# Altium project DotexBoard_PRJ.PrjPcb
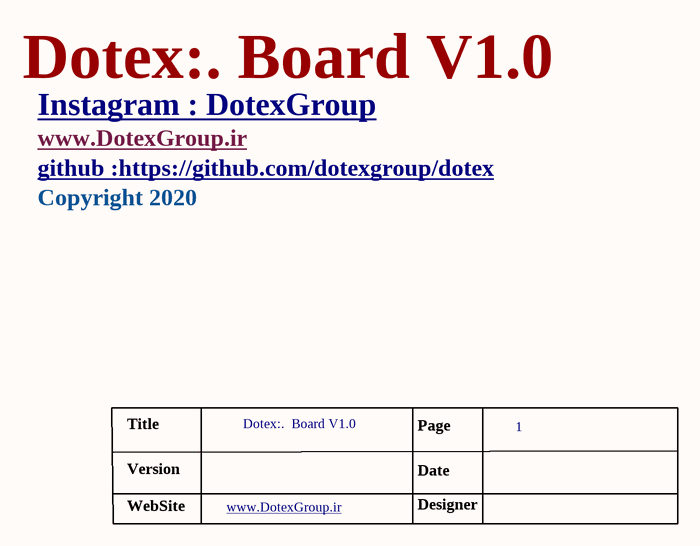
[diagram p0: [00]_DoteXGroup.SchDoc]
designer: Dotex:.; version: V1.0
4 sheets, 114 parts. Net scope: flat (ports and power ports of the same name join across sheets).
Board file: DotexBoard_PCB.PcbDoc
Sheets:
  [00]_DoteXGroup.SchDoc
  [1]DotexBoard_MCU.SchDoc
  [2]DotexBoard_ENC28J60.SchDoc
  [3]DotexBoard_Interfaces.SchDoc

## Sheet [00]_DoteXGroup.SchDoc
size A

### Notes on the sheet
- Dotex:. Board V1.0
- Instagram : DotexGroup <https://www.instagram.com/dotexgroup/>
- www.DotexGroup.ir <http://www.DotexGroup.ir>
- Copyright 2020
- github :https://github.com/dotexgroup/dotex <https://github.com/dotexgroup/dotex>
- Title
- Dotex:.  Board V1.0
- Page
- 1
- Version
- WebSite
- www.DotexGroup.ir <http://www.DotexGwww.DotexGroup.irroup.ir>
- Date
- Designer

## Sheet [1]DotexBoard_MCU.SchDoc
size B
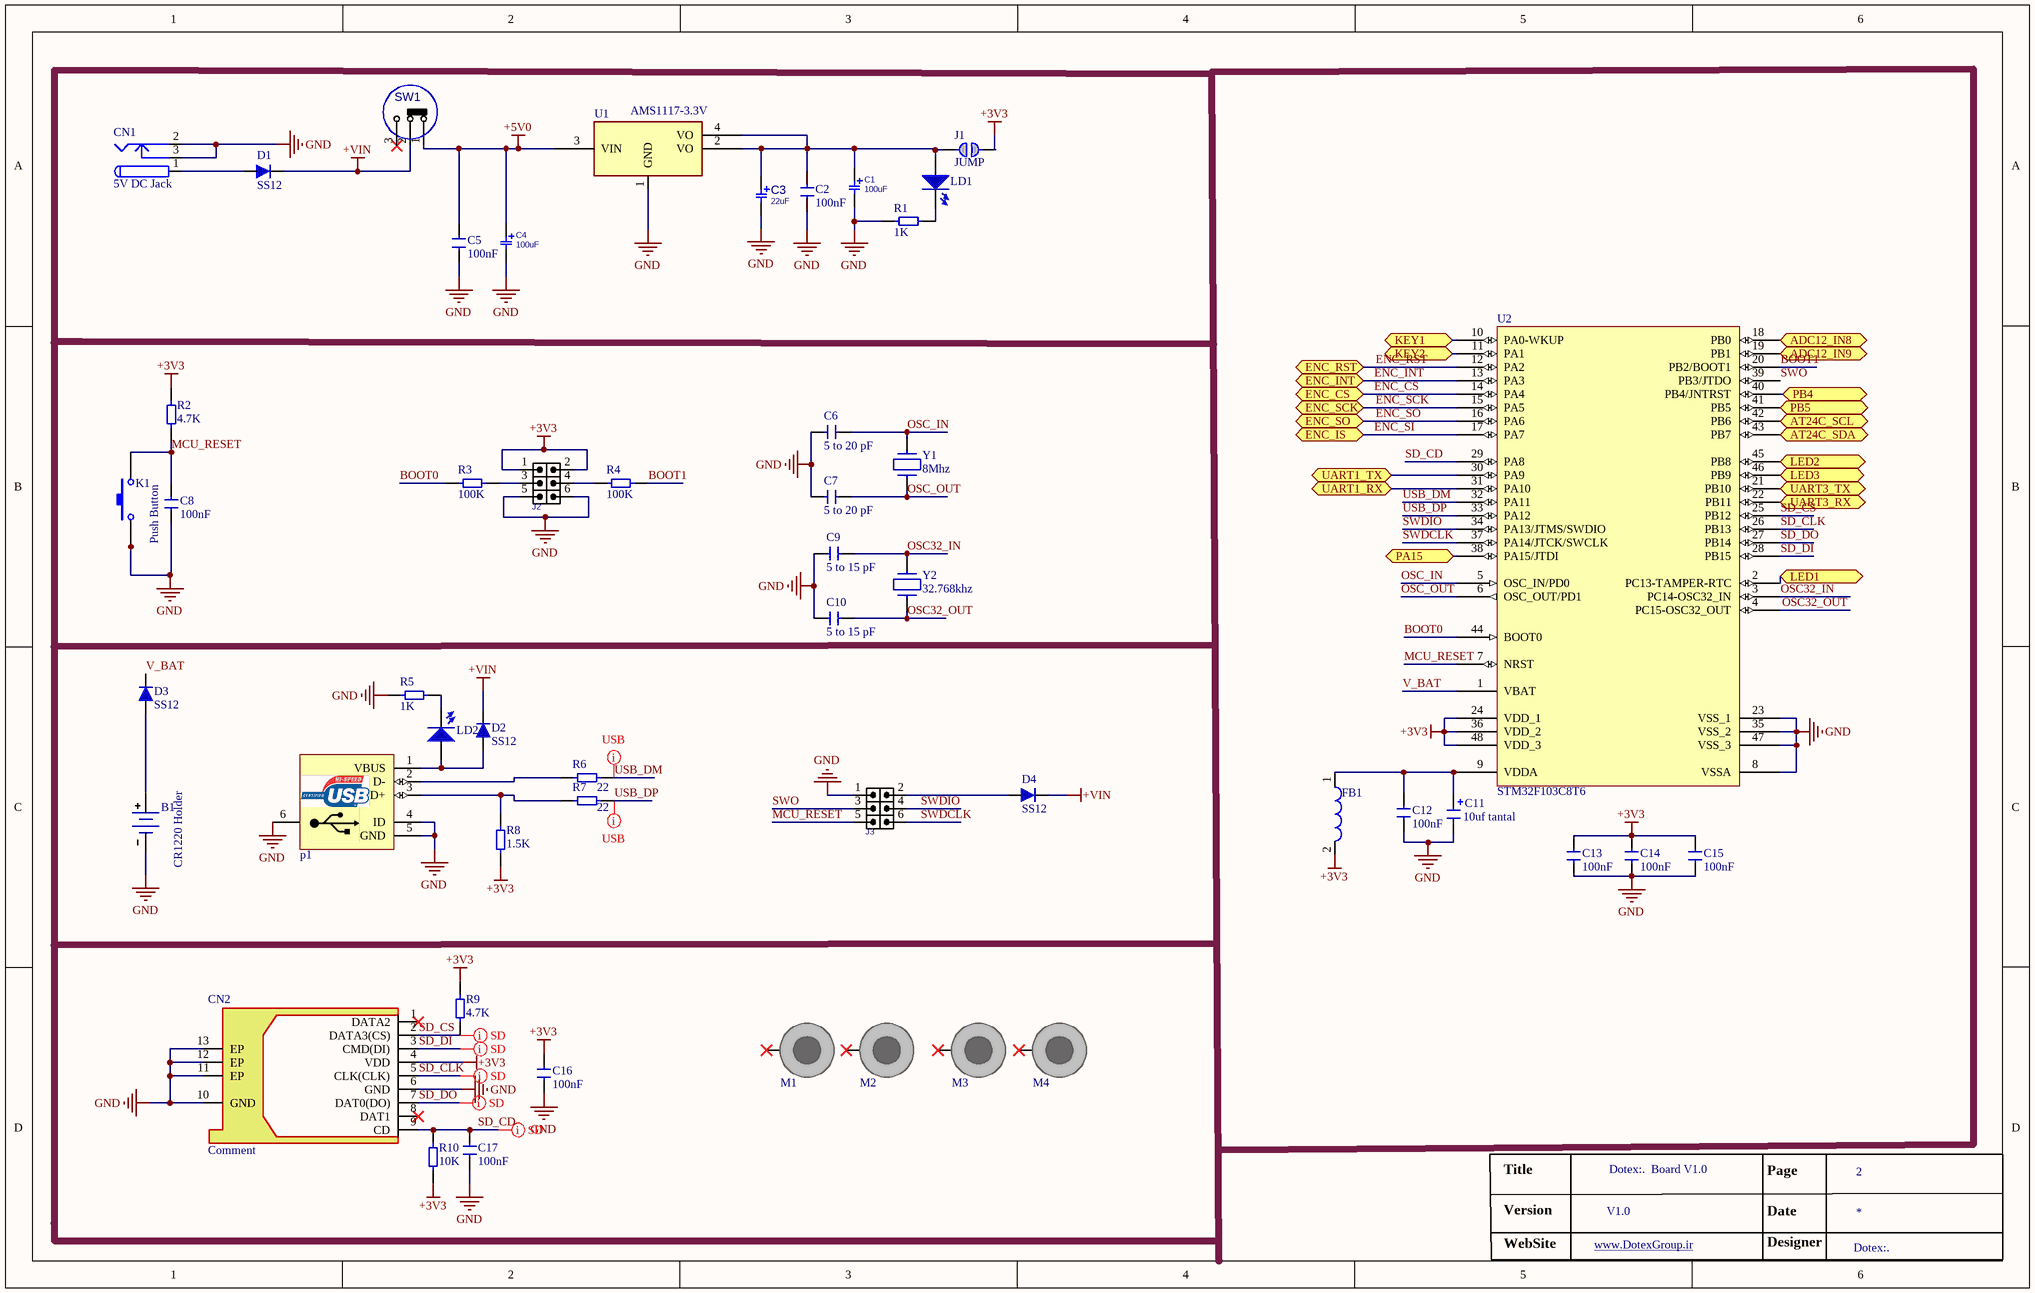
[diagram p1: [1]DotexBoard_MCU.SchDoc]

### Parts
B1  CR1220 Holder  [Battery socket SMD]
C1  value 100uF  [C_EL_6_6]  (hidden comment: Comment)
C2  Comment  [0805 Capacitor]  (value not drawn)
C3  22uF  [C_EL_5]
C4  value 100uF  [C_EL_6_6]  (hidden comment: Comment)
C5  Comment  [0805 Capacitor]  (value not drawn)
C6  Comment  [0805 Capacitor]  (value not drawn)
C7  Comment  [0805 Capacitor]  (value not drawn)
C8  Comment  [0805 Capacitor]  (value not drawn)
C9  Comment  [0805 Capacitor]  (value not drawn)
C10  Comment  [0805 Capacitor]  (value not drawn)
C11  10uf tantal  [Tantalium Size A]
C12  Comment  [0805 Capacitor]  (value not drawn)
C13  Comment  [0805 Capacitor]  (value not drawn)
C14  Comment  [0805 Capacitor]  (value not drawn)
C15  Comment  [0805 Capacitor]  (value not drawn)
C16  Comment  [0805 Capacitor]  (value not drawn)
C17  Comment  [0805 Capacitor]  (value not drawn)
CN1  5V DC Jack  [Power Jack]
CN2  Comment  [Micro SD Card]
D1  SS12  [DO-214AC(SMA)]
D2  SS12  [DO-214AC(SMA)]
D3  SS12  [DO-214AC(SMA)]
D4  SS12  [DO-214AC(SMA)]
FB1  Comment  [0805 Ferrit Bead]  (value not drawn)
J1  JUMP  [0805 Capacitor]
J2  HDRM_2X3  [HDR_M_2X3]  (value not drawn)
J3  HDRM_2X3  [HDR_M_2X3]  (value not drawn)
K1  Push Button  [Push Kay 4 KFC]
LD1  LED  [LED_0805 Y]  (value not drawn)
LD2  LED  [LED_0805 Y]  (value not drawn)
M1  Comment  [SCMH_M3]  (value not drawn)  (no BOM)
M2  Comment  [SCMH_M3]  (value not drawn)  (no BOM)
M3  Comment  [SCMH_M3]  (value not drawn)  (no BOM)
M4  Comment  [SCMH_M3]  (value not drawn)  (no BOM)
p1  USB Connector  [USB_AB_BM_SHS]  (value not drawn)
R1  Comment  [0805 Resistor]  (value not drawn)
R2  Comment  [0805 Resistor]  (value not drawn)
R3  Comment  [0805 Resistor]  (value not drawn)
R4  Comment  [0805 Resistor]  (value not drawn)
R5  Comment  [0805 Resistor]  (value not drawn)
R6  Comment  [0805 Resistor]  (value not drawn)
R7  Comment  [0805 Resistor]  (value not drawn)
R8  Comment  [0805 Resistor]  (value not drawn)
R9  Comment  [0805 Resistor]  (value not drawn)
R10  Comment  [0805 Resistor]  (value not drawn)
SW1  SlideSwitch  [SWSLIDT_SPDT_R_8X4]  (value not drawn)
U1  value AMS1117-3.3V  [SOT223_4]  (hidden comment: Comment)
U2  STM32F103C8T6  [LQFP48_N]
Y1  8Mhz  [Xtal 2p]
Y2  32.768khz  [Xtal 32.782khz]

### Ports
ADC12_IN8 (bidir), ADC12_IN9 (bidir), AT24C_SCL (bidir), AT24C_SDA (bidir), ENC_CS (bidir), ENC_INT (bidir), ENC_IS (bidir), ENC_RST (bidir), ENC_SCK (bidir), ENC_SO (bidir), KEY1 (bidir), KEY2 (bidir), LED1 (bidir), LED2 (bidir), LED3 (bidir), PA15 (bidir), PB4 (bidir), PB5 (bidir), UART1_RX (bidir), UART1_TX (bidir), UART3_RX (bidir), UART3_TX (bidir)

### Nets
+3V3: C13.2 C14.2 C15.2 C16.2 CN2.4(VDD) FB1.2 J1.2 J2.1 J2.2 R2.1 R8.1 R9.1 R10.2 U2.24(VDD_1) U2.36(VDD_2) U2.48(VDD_3)
+5V0: C4.1 C5.2 SW1.1(P1) U1.3(VIN)
+VIN: D1.2(K) D2.2(K) D4.2(K) SW1.2(P3)
GND: B1.2(-) C1.2 C2.1 C3.2 C4.2 C5.1 C6.1 C7.2 C8.2 C9.1 C10.2 C11.2 C12.1 C13.1 C14.1 C15.1 C16.1 C17.2 CN1.2 CN1.3 CN2.6(GND) CN2.10(GND) CN2.11(EP) CN2.12(EP) CN2.13(EP) J2.5 J2.6 J3.1 K1.1 p1.4(ID) p1.5(GND) p1.6(MH) R1.2 R5.2 U1.1(GND) U2.8(VSSA) U2.23(VSS_1) U2.35(VSS_2) U2.47(VSS_3)
AIN8: U2.18(PB0) ; port ADC12_IN8
AIN9: U2.19(PB1) ; port ADC12_IN9
BOOT0: R3.1 U2.44(BOOT0)
BOOT1: R4.2 U2.20(PB2/BOOT1)
ENC_CS: U2.14(PA4) ; port ENC_CS
ENC_INT: U2.13(PA3) ; port ENC_INT
ENC_RST: U2.12(PA2) ; port ENC_RST
ENC_SCK: U2.15(PA5) ; port ENC_SCK
ENC_SI: U2.17(PA7) ; port ENC_IS
ENC_SO: U2.16(PA6) ; port ENC_SO
MCU_RESET: C8.1 J3.5 K1.2 R2.2 U2.7(NRST)
OSC32_IN: C9.2 U2.3(PC14-OSC32_IN) Y2.1
OSC32_OUT: C10.1 U2.4(PC15-OSC32_OUT) Y2.2
OSC_IN: C6.2 U2.5(OSC_IN/PD0) Y1.2
OSC_OUT: C7.1 U2.6(OSC_OUT/PD1) Y1.1
PA15: U2.38(PA15/JTDI) ; port PA15
PB4: U2.40(PB4/JNTRST) ; port PB4
PB5: U2.41(PB5) ; port PB5
RX: U2.22(PB11) ; port UART3_RX
SD_CD: C17.1 CN2.9(CD) R10.1 U2.29(PA8)
SD_CLK: CN2.5(CLK(CLK)) U2.26(PB13)
SD_CS: CN2.2(DATA3(CS)) R9.2 U2.25(PB12)
SD_DI: CN2.3(CMD(DI)) U2.28(PB15)
SD_DO: CN2.7(DAT0(DO)) U2.27(PB14)
SWDCLK: J3.6 U2.37(PA14/JTCK/SWCLK)
SWDIO: J3.4 U2.34(PA13/JTMS/SWDIO)
SWO: J3.3 U2.39(PB3/JTDO)
TX: U2.21(PB10) ; port UART3_TX
USB_DM: R6.2 U2.32(PA11)
USB_DP: R7.2 U2.33(PA12)
V_BAT: D3.2(K) U2.1(VBAT)
NetB1_1: B1.1(+) D3.1(A)
NetC1_1: C1.1 C2.2 C3.1 J1.1 LD1.1(A) U1.2(VO) U1.4(VO)
NetC11_1: C11.1 C12.2 FB1.1 U2.9(VDDA)
NetC29_1: U2.10(PA0-WKUP) ; port KEY1
NetC30_1: U2.11(PA1) ; port KEY2
NetCN1_1: CN1.1 D1.1(A)
NetD2_1: D2.1(A) LD2.1(A) p1.1(VBUS)
NetD4_1: D4.1(A) J3.2
NetJ2_3: J2.3 R3.2
NetJ2_4: J2.4 R4.1
NetLD1_2: LD1.2(K) R1.1
NetLD2_2: LD2.2(K) R5.1
Netp1_2: p1.2(D-) R6.1
Netp1_3: p1.3(D+) R7.1 R8.2
NetR24_1: U2.2(PC13-TAMPER-RTC) ; port LED1
NetR25_1: U2.45(PB8) ; port LED2
NetR26_1: U2.46(PB9) ; port LED3
NetR27_2: U2.42(PB6) ; port AT24C_SCL
NetR28_2: U2.43(PB7) ; port AT24C_SDA
NetU2_30: U2.30(PA9) ; port UART1_TX
NetU2_31: U2.31(PA10) ; port UART1_RX

Not connected (* = marked no-connect by the designer): CN2 1(DATA2)* 8(DAT1)*; M1 1*; M2 1*; M3 1*; M4 1*; SW1 3(P4)*

### Layout directives
net class SD_card: SD_CD, SD_CLK, SD_CS, SD_DI, SD_DO
net class USB: USB_DM, USB_DP

### Notes on the sheet
- Title
- Dotex:.  Board V1.0
- Page
- 2
- Version
- WebSite
- www.DotexGroup.ir <http://www.DotexGwww.DotexGroup.irroup.ir>
- Date
- Designer
- (in symbol Capacitor SMD) 100nF; 5 to 20 pF; 5 to 15 pF
- (in symbol Resistor SMD) 1K; 4.7K; 100K; 22; 1.5K; 10K

### Library data of the parts
B1 = Battry Backup
C1 C4 = CAP_THD_EL_10u25V: CAP, THD, ELEC, 10uF, 25V; MANF_P#: MANF_PART#; PARAM: 25V; MANF: MANF; PARAM2: PARAM2
C2 C5-C10 C12-C17 = Capacitor SMD
C3 = CAP_SMD_EL_100u10V: CAP, SMDD, ELEC, 100uF, 10V; MANF_P#: 875105242010; MANF: Wurth Electronics; DESC: Aluminum Organic Polymer; DIST#: MOUSER; PARAM: 20%, 30mOhmESR, -55~105oC; PRICE: 0.56$; PARAM2: 10V; ASSEMBLY: ASSEMBLY; VALUE: 22uF
C11 = Capacitor Tantalium
CN1 = Power Jack
CN2 = Micro SD Card
D1-D4 = 1N4001
FB1 = Ferrit Bead
J1 = jumper SMD
J2 J3 = HDR_M_2X3: CONN, HEADER, Male, pitch: 2.54mm, 6POS; MANF_P#: MANF_PART#; MANF: MANF; VALUE: HDRM_2X3
K1 = Push Kay
LD1 LD2 = LED SMD
M1-M4 = SCMH_M1P6: SCREW mouting, M1.6, 1.6mm diameter and 3.2mm PanHead; VALUE: DNP/MH; ASSEMBLY: DNP
p1 = USB AB MICRO CONNECTOR: USB MICRO-B Type Connector; Designer: ABBAS BASEREH; Max Current: 1600mA; Mounting Technology: Surface Mount\Through-Hole; Category: Connector; Pin Count: 5-7; Publisher: ABBAS BASEREH; Status: Unreleased; ComponentLink1Description: Datasheet; ComponentLink2Description: Reference; Update: 1395-11-17
R1-R10 = Resistor SMD
SW1 = SWSLIDT_SPDT_S_8X4: SWITCH, SLIDE, SPDT, 8.6X4.3mm, THD; MANF_PART#: OS102011MS2QN1; MANF: C&K; DESC: DESCRIPTION; VALUE: SlideSwitch; ASSEMBLY: ASSEMBLY; PARAM: PARAM; PRICE: 0.4$
U1 = VREG_1117_SOT223: REG, Linear, LDO1V, 0.8A, SOT-223; MANF_P#: LD1117, LM1117, AMS1117, TLV1117, REG1117, NCP1117, LT1117, SPX1117; MANF: TI, ON, ST; PARAM2: 1.2/1.5/1.8/2.5/2.85/3.3/5V; PARAM: LDO1V, 0.8A
U2 = STM32F103C8T6: STM32 ARM-based 32-bit MCU with 64 Kbytes Flash, 48-pin LQFP, Industrial Temperature; Published: 30-May-2008; DatasheetVersion: rev6, Mar-2008; PackageVersion: Mar-2008; PackageReference: LQFP48; Publisher: Altium Limited; PackageDescription: 48-Pin Low-Profile Quad Flat Pack, 7 x 7 mm Body, 0.5 mm Pitch (LQFP48); ComponentLink1Description: Manufacturer Link; ComponentLink1URL: www.st.com/stm32; ComponentLink2Description: Datasheet; ComponentLink2URL: http://www.st.com/stonline/products/literature/ds/13587.pdf
Y1 Y2 = Xtal

## Sheet [2]DotexBoard_ENC28J60.SchDoc
size B
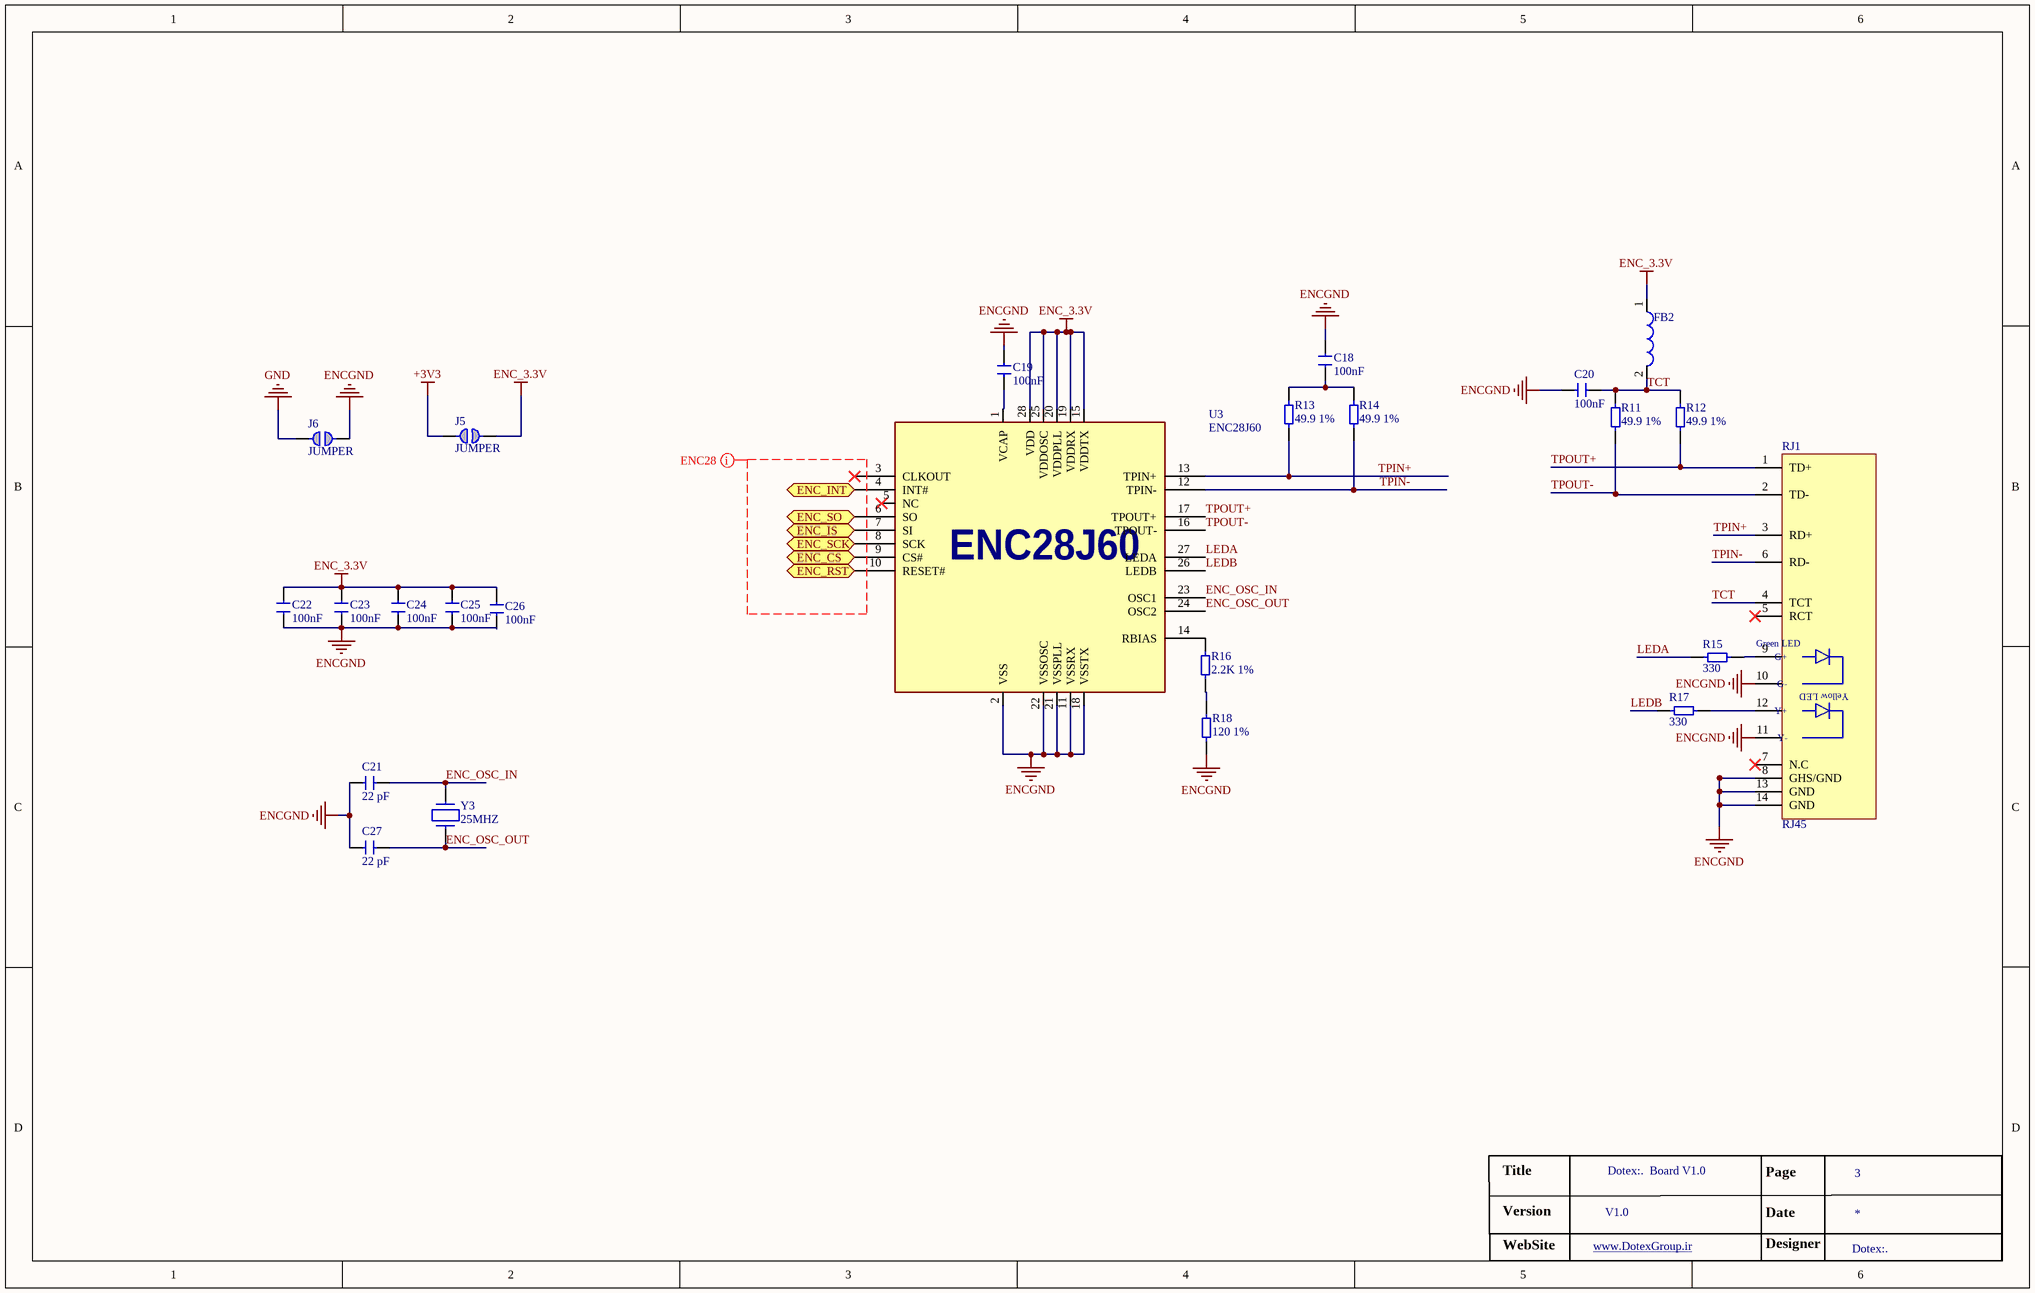
[diagram p2: [2]DotexBoard_ENC28J60.SchDoc]

### Parts
C18  Comment  [0805 Capacitor]  (value not drawn)
C19  Comment  [0805 Capacitor]  (value not drawn)
C20  Comment  [0805 Capacitor]  (value not drawn)
C21  Comment  [0805 Capacitor]  (value not drawn)
C22  Comment  [0805 Capacitor]  (value not drawn)
C23  Comment  [0805 Capacitor]  (value not drawn)
C24  Comment  [0805 Capacitor]  (value not drawn)
C25  Comment  [0805 Capacitor]  (value not drawn)
C26  Comment  [0805 Capacitor]  (value not drawn)
C27  Comment  [0805 Capacitor]  (value not drawn)
FB2  Comment  [0805 Ferrit Bead]  (value not drawn)
J5  JUMPER  [0603 Resistor]
J6  JUMPER  [0603 Resistor]
R11  Comment  [0805 Resistor]  (value not drawn)
R12  Comment  [0805 Resistor]  (value not drawn)
R13  Comment  [0805 Resistor]  (value not drawn)
R14  Comment  [0805 Resistor]  (value not drawn)
R15  Comment  [0805 Resistor]  (value not drawn)
R16  Comment  [0805 Resistor]  (value not drawn)
R17  Comment  [0805 Resistor]  (value not drawn)
R18  Comment  [0805 Resistor]  (value not drawn)
RJ1  RJ45  [HR91105A-RJ45]
U3  value ENC28J60  [SO_28_W]  (hidden comment: Comment)
Y3  25MHZ  [Xtal 2p]

### Ports
ENC_CS (bidir), ENC_INT (bidir), ENC_IS (bidir), ENC_RST (bidir), ENC_SCK (bidir), ENC_SO (bidir)

### Nets
+3V3: J5.1
ENC_3.3V: C22.2 C23.2 C24.2 C25.2 C26.2 FB2.1 J5.2 U3.15(VDDTX) U3.19(VDDRX) U3.20(VDDPLL) U3.25(VDDOSC) U3.28(VDD)
ENCGND: C18.1 C19.2 C20.2 C21.1 C22.1 C23.1 C24.1 C25.1 C26.1 C27.2 J6.2 R18.2 RJ1.8(GHS/GND) RJ1.10 RJ1.11 RJ1.13(GND) RJ1.14(GND) U3.2(VSS) U3.11(VSSRX) U3.18(VSSTX) U3.21(VSSPLL) U3.22(VSSOSC)
GND: J6.1
ENC_CS: U3.9(CS#) ; port ENC_CS
ENC_INT: U3.4(INT#) ; port ENC_INT
ENC_OSC_IN: C21.2 U3.23(OSC1) Y3.2
ENC_OSC_OUT: C27.1 U3.24(OSC2) Y3.1
ENC_RST: U3.10(RESET#) ; port ENC_RST
ENC_SCK: U3.8(SCK) ; port ENC_SCK
ENC_SI: U3.7(SI) ; port ENC_IS
ENC_SO: U3.6(SO) ; port ENC_SO
LEDA: R15.1 U3.27(LEDA)
LEDB: R17.2 U3.26(LEDB)
TCT: C20.1 FB2.2 R11.1 R12.1 RJ1.4(TCT)
TPIN+: R13.2 RJ1.3(RD+) U3.13(TPIN+)
TPIN-: R14.2 RJ1.6(RD-) U3.12(TPIN-)
TPOUT+: R12.2 RJ1.1(TD+) U3.17(TPOUT+)
TPOUT-: R11.2 RJ1.2(TD-) U3.16(TPOUT-)
NetC18_2: C18.2 R13.1 R14.1
NetC19_1: C19.1 U3.1(VCAP)
NetR15_2: R15.2 RJ1.9
NetR16_1: R16.1 U3.14(RBIAS)
NetR16_2: R16.2 R18.1
NetR17_1: R17.1 RJ1.12

Not connected (* = marked no-connect by the designer): RJ1 5(RCT)* 7(N.C)*; U3 3(CLKOUT)* 5(NC)*

### Layout directives
net class ENC28: (no net found under the mark)

### Notes on the sheet
- Title
- Dotex:.  Board V1.0
- Page
- 3
- Version
- Date
- Designer
- WebSite
- www.DotexGroup.ir <http://www.DotexGwww.DotexGroup.irroup.ir>
- Size:
- Date:
- B
- Number:
- Time:
- Revision:
- Sheet
- of
- File:
- (in symbol Capacitor SMD) 22 pF; 100nF
- (in symbol HR911105A) Green LED; G+; G-; Yellow LED; Y+; Y-
- (in symbol Resistor SMD) 2.2K 1%; 330; 49.9 1%; 120 1%

### Library data of the parts
C18-C27 = Capacitor SMD
FB2 = Ferrit Bead
J5 J6 = jumper SMD
R11-R18 = Resistor SMD
RJ1 = HR911105A
U3 = ENC28J60_SOP: Ethernet Controller, 10/100, MII/RMII; MANF: Microchip; MANF_P#: ENC28J60-I/SO, ENC28J60-C/SO
Y3 = Xtal

## Sheet [3]DotexBoard_Interfaces.SchDoc
size B
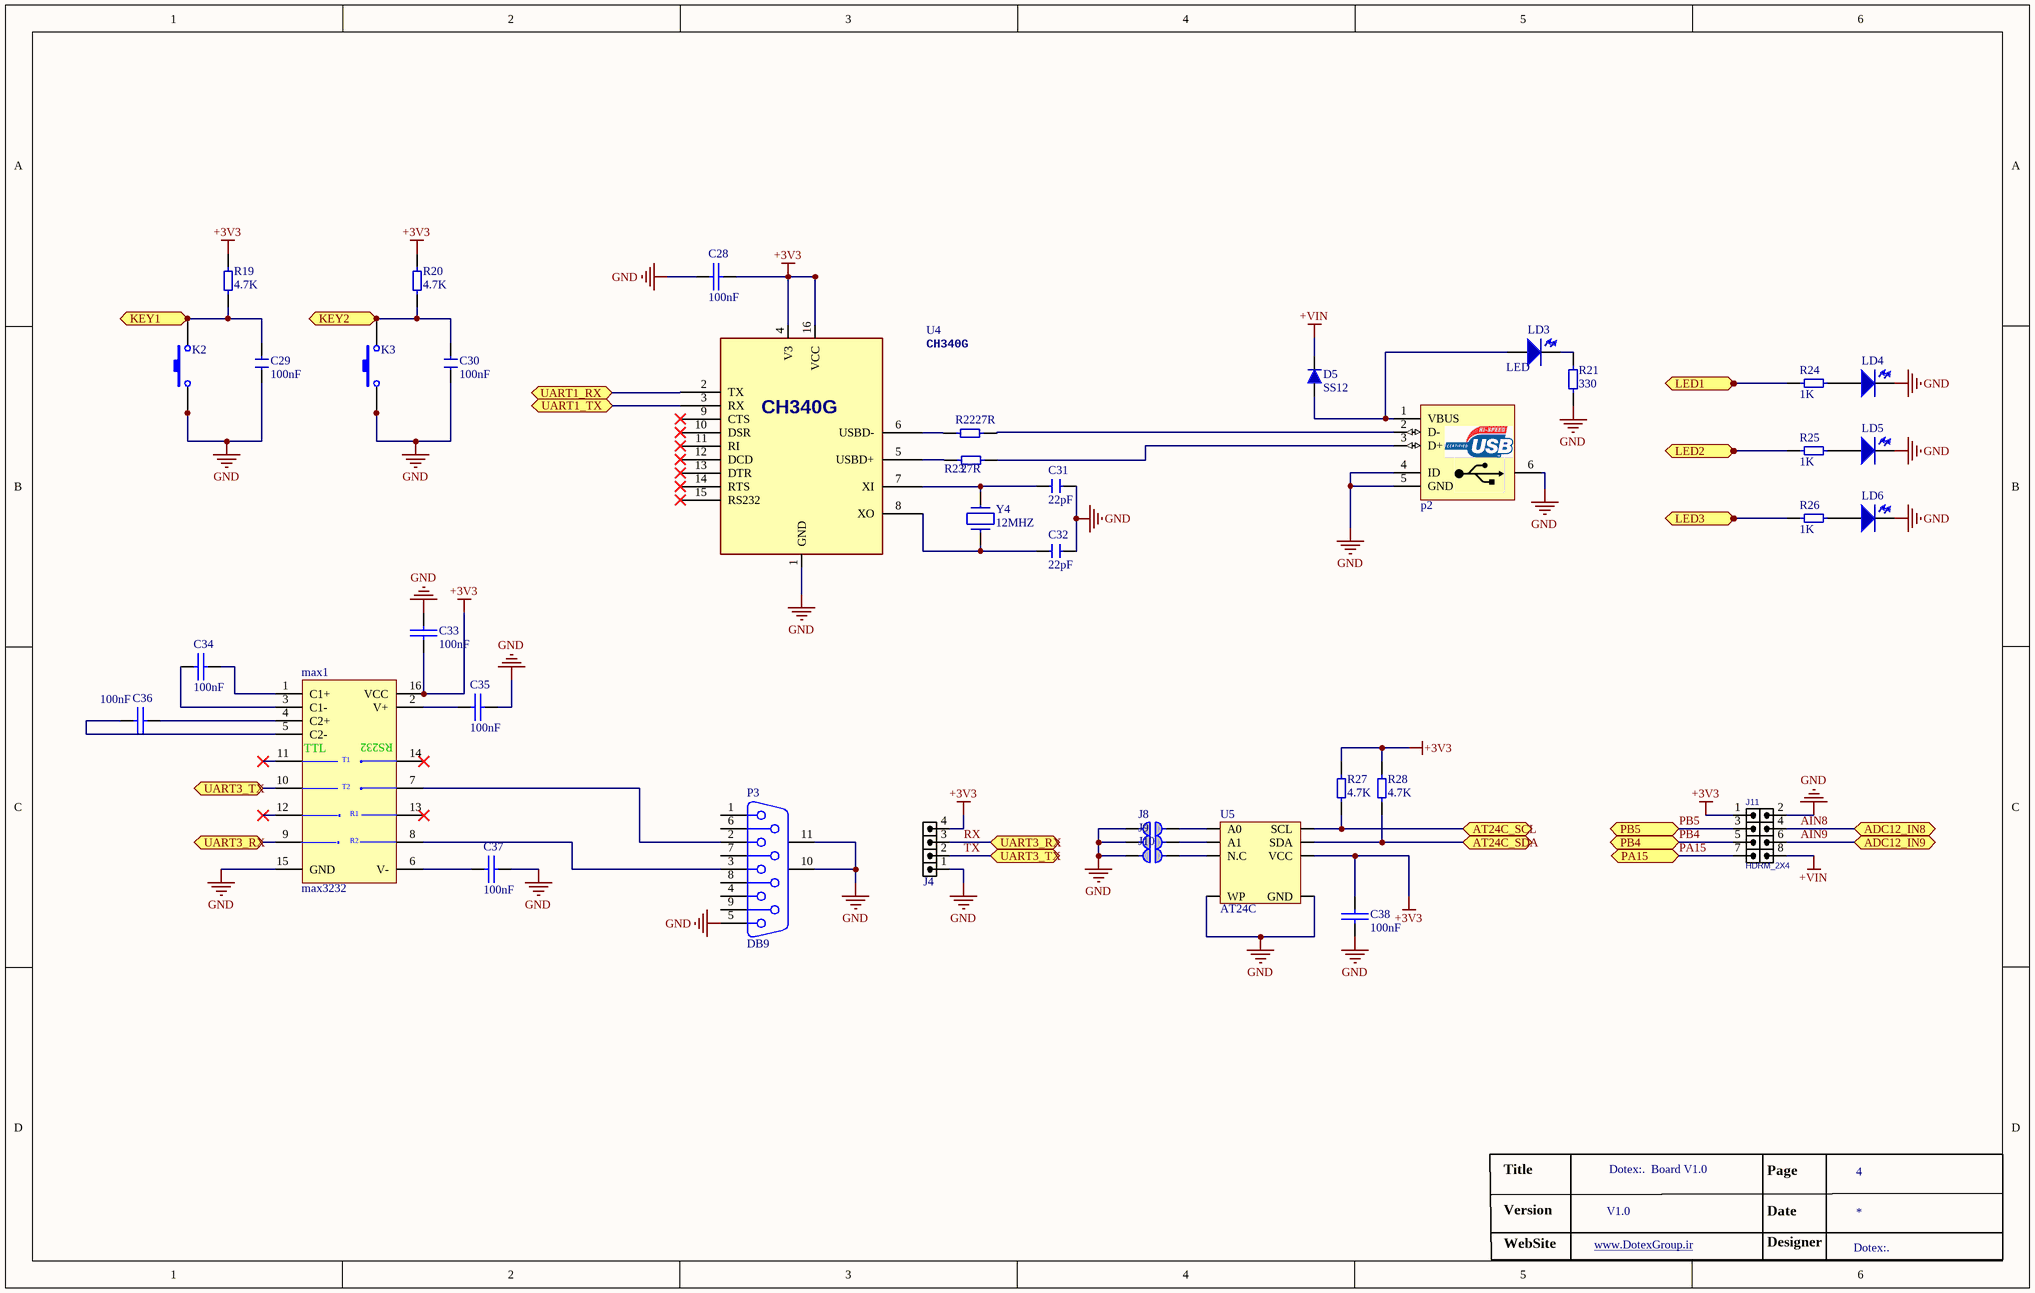
[diagram p3: [3]DotexBoard_Interfaces.SchDoc]

### Parts
C28  value 100nF  [0805 Capacitor]  (hidden comment: Comment)
C29  Comment  [0805 Capacitor]  (value not drawn)
C30  Comment  [0805 Capacitor]  (value not drawn)
C31  Comment  [0805 Capacitor]  (value not drawn)
C32  Comment  [0805 Capacitor]  (value not drawn)
C33  value 100nF  [0805 Capacitor]  (hidden comment: Comment)
C34  value 100nF  [0805 Capacitor]  (hidden comment: Comment)
C35  value 100nF  [0805 Capacitor]  (hidden comment: Comment)
C36  value 100nF  [0805 Capacitor]  (hidden comment: Comment)
C37  value 100nF  [0805 Capacitor]  (hidden comment: Comment)
C38  value 100nF  [0805 Capacitor]  (hidden comment: Comment)
D5  SS12  [DO-214AC(SMA)]
J4  HDR1X4  [HDR_M_1X4]  (value not drawn)
J8  Comment  [0603 Resistor]  (value not drawn)
J9  Comment  [0603 Resistor]  (value not drawn)
J10  Comment  [0603 Resistor]  (value not drawn)
J11  HDRM_2X4  [HDR_M_2X4]
K2  Comment  [Push Kay 4 KFC]  (value not drawn)
K3  Comment  [Push Kay 4 KFC]  (value not drawn)
LD3  LED  [LED_0805 Y]
LD4  Comment  [LED_0805 Y]  (value not drawn)
LD5  Comment  [LED_0805 Y]  (value not drawn)
LD6  Comment  [LED_0805 Y]  (value not drawn)
max1  max3232  [SO-16]
p2  USB Connector  [USB_AB_BM_SHS]  (value not drawn)
P3  DB9  [DB9 Female]
R19  Comment  [0805 Resistor]  (value not drawn)
R20  Comment  [0805 Resistor]  (value not drawn)
R21  Comment  [0805 Resistor]  (value not drawn)
R22  Comment  [0805 Resistor]  (value not drawn)
R23  Comment  [0805 Resistor]  (value not drawn)
R24  Comment  [0805 Resistor]  (value not drawn)
R25  Comment  [0805 Resistor]  (value not drawn)
R26  Comment  [0805 Resistor]  (value not drawn)
R27  Comment  [0805 Resistor]  (value not drawn)
R28  Comment  [0805 Resistor]  (value not drawn)
U4  CH340G  [SO-16]
U5  AT24C  [SOIC-8]
Y4  12MHZ  [Xtal 2p]

### Ports
ADC12_IN8 (bidir), ADC12_IN9 (bidir), AT24C_SCL (bidir), AT24C_SDA (bidir), KEY1 (bidir), KEY2 (bidir), LED1 (bidir), LED2 (bidir), LED3 (bidir), PA15 (bidir), PB4 (bidir), PB5 (bidir), UART1_RX (bidir), UART1_TX (bidir), UART3_RX (bidir), UART3_TX (bidir)

### Nets
+3V3: C28.2(-) C33.1(+) C38.1(+) J4.4 J11.1 max1.16(VCC) R19.1 R20.1 R27.1 R28.1 U4.4(V3) U4.16(VCC) U5.8(VCC)
+VIN: D5.2(K) J11.8
GND: C28.1(+) C29.2 C30.2 C31.1 C32.2 C33.2(-) C35.2(-) C37.2(-) C38.2(-) J4.1 J8.1 J9.1 J10.1 J11.2 K2.1 K3.1 LD4.2(K) LD5.2(K) LD6.2(K) max1.15(GND) p2.4(ID) p2.5(GND) p2.6(MH) P3.5 P3.10(MH1) P3.11(MH2) R21.2 U4.1(GND) U5.4(GND) U5.7(WP)
AIN8: J11.4 ; port ADC12_IN8
AIN9: J11.6 ; port ADC12_IN9
PA15: J11.7 ; port PA15
PB4: J11.5 ; port PB4
PB5: J11.3 ; port PB5
RX: J4.3 max1.9(R2OUT) ; port UART3_RX
TX: J4.2 max1.10(T2IN) ; port UART3_TX
NetC29_1: C29.1 K2.2 R19.2 ; port KEY1
NetC30_1: C30.1 K3.2 R20.2 ; port KEY2
NetC31_2: C31.2 U4.7(XI) Y4.2
NetC32_1: C32.1 U4.8(XO) Y4.1
NetC34_1: C34.1(+) max1.1(C1+)
NetC34_2: C34.2(-) max1.3(C1-)
NetC35_1: C35.1(+) max1.2(V+)
NetC36_1: C36.1(+) max1.5(C2-)
NetC36_2: C36.2(-) max1.4(C2+)
NetC37_1: C37.1(+) max1.6(V-)
NetD5_1: D5.1(A) LD3.1(A) p2.1(VBUS)
NetJ8_2: J8.2 U5.1(A0)
NetJ9_2: J9.2 U5.2(A1)
NetJ10_2: J10.2 U5.3(N.C)
NetLD3_2: LD3.2(K) R21.1
NetLD4_1: LD4.1(A) R24.2
NetLD5_1: LD5.1(A) R25.2
NetLD6_1: LD6.1(A) R26.2
Netmax1_7: max1.7(T2OUT) P3.2
Netmax1_8: max1.8(R2IN) P3.3
Netp2_2: p2.2(D-) R22.2
Netp2_3: p2.3(D+) R23.2
NetR22_1: R22.1 U4.6(USBD-)
NetR23_1: R23.1 U4.5(USBD+)
NetR24_1: R24.1 ; port LED1
NetR25_1: R25.1 ; port LED2
NetR26_1: R26.1 ; port LED3
NetR27_2: R27.2 U5.6(SCL) ; port AT24C_SCL
NetR28_2: R28.2 U5.5(SDA) ; port AT24C_SDA
NetU2_30: U4.3(RX) ; port UART1_TX
NetU2_31: U4.2(TX) ; port UART1_RX

Not connected (* = marked no-connect by the designer): max1 11(T1IN)* 12(R1OUT)* 13(R1IN)* 14(T1OUT)*; P3 1 4 6 7 8 9; U4 9(CTS)* 10(DSR)* 11(RI)* 12(DCD)* 13(DTR)* 14(RTS)* 15(RS232)*

### Notes on the sheet
- Title
- Dotex:.  Board V1.0
- Page
- 4
- Version
- WebSite
- www.DotexGroup.ir <http://www.DotexGwww.DotexGroup.irroup.ir>
- Date
- Designer
- (in symbol Capacitor SMD) 100nF; 22pF
- (in symbol MAX232) TTL; RS232; T1; T2; R1; R2
- (in symbol Resistor SMD) 4.7K; 330; 27R; 1K

### Library data of the parts
C28 C33-C38 = Cap-Bipolar: Bipolar Capacitor; Voltage: 100V; Designer: Saeid Jorablo; Organazation: ControTec; Adding Date: 1387/12/20
C29-C32 = Capacitor SMD
D5 = 1N4001
J4 = HDR_M_1X4: CONN, HEADER, Male, pitch: 2.54mm, 4POS; VALUE: HDRM4
J8-J10 = jumper SMD
J11 = HDR_M_2X4: CONN, HEADER, Male, pitch: 2.54mm, 8POS; MANF_P#: MANF_PART#; MANF: MANF; VALUE: HDRM_2X4
K2 K3 = Push Kay
LD3-LD6 = LED SMD
max1 = MAX232: +5V Powered, Multi-Channel RS-232 Driver/Receiver; ComponentAuthor: Saeid Jorablo; ComponentLink1Description: Datasheet; ComponentLink1URL: http://pdfserv.maxim-ic.com/en/ds/MAX220-MAX249.pdf
p2 = USB AB MICRO CONNECTOR: as p1 on sheet [1]DotexBoard_MCU; Mounting Technology: Surface Mount\Through-Hole; Category: Connector; Pin Count: 5-7; Publisher: ABBAS BASEREH; Status: Unreleased; ComponentLink1Description: Datasheet; ComponentLink2Description: Reference; Update: 1395-11-17
P3 = DB9 Connector: Receptacle Assembly, 9 Position, Right Angle; PackageDocument: O; Positions: 9; Published: 15-Jun-2001; LatestRevisionDate: 17-Jul-2002; LatestRevisionNote: Re-released for DXP Platform.; DatasheetDocument: 1-Sep-1999; PackageReference: 788750; Publisher: Altium Limited; Orientation: Right Angle; Gender: Receptacle
R19-R28 = Resistor SMD
U4 = CH340G_SOP16: USB-UART; MANF_P#: CH340G; VALUE: CH340G
U5 = AT24C128
Y4 = Xtal

## Nets that join several sheets
+3V3: [1]DotexBoard_MCU (16 pins), [2]DotexBoard_ENC28J60 (J5.1), [3]DotexBoard_Interfaces (13 pins)
+VIN: [1]DotexBoard_MCU (D1.2 D2.2 D4.2 SW1.2), [3]DotexBoard_Interfaces (D5.2 J11.8)
GND: [1]DotexBoard_MCU (39 pins), [2]DotexBoard_ENC28J60 (J6.1), [3]DotexBoard_Interfaces (30 pins)
AIN8: [1]DotexBoard_MCU (U2.18), [3]DotexBoard_Interfaces (J11.4)
AIN9: [1]DotexBoard_MCU (U2.19), [3]DotexBoard_Interfaces (J11.6)
ENC_CS: [1]DotexBoard_MCU (U2.14), [2]DotexBoard_ENC28J60 (U3.9)
ENC_INT: [1]DotexBoard_MCU (U2.13), [2]DotexBoard_ENC28J60 (U3.4)
ENC_RST: [1]DotexBoard_MCU (U2.12), [2]DotexBoard_ENC28J60 (U3.10)
ENC_SCK: [1]DotexBoard_MCU (U2.15), [2]DotexBoard_ENC28J60 (U3.8)
ENC_SI: [1]DotexBoard_MCU (U2.17), [2]DotexBoard_ENC28J60 (U3.7)
ENC_SO: [1]DotexBoard_MCU (U2.16), [2]DotexBoard_ENC28J60 (U3.6)
NetC29_1: [1]DotexBoard_MCU (U2.10), [3]DotexBoard_Interfaces (C29.1 K2.2 R19.2)
NetC30_1: [1]DotexBoard_MCU (U2.11), [3]DotexBoard_Interfaces (C30.1 K3.2 R20.2)
NetR24_1: [1]DotexBoard_MCU (U2.2), [3]DotexBoard_Interfaces (R24.1)
NetR25_1: [1]DotexBoard_MCU (U2.45), [3]DotexBoard_Interfaces (R25.1)
NetR26_1: [1]DotexBoard_MCU (U2.46), [3]DotexBoard_Interfaces (R26.1)
NetR27_2: [1]DotexBoard_MCU (U2.42), [3]DotexBoard_Interfaces (R27.2 U5.6)
NetR28_2: [1]DotexBoard_MCU (U2.43), [3]DotexBoard_Interfaces (R28.2 U5.5)
NetU2_30: [1]DotexBoard_MCU (U2.30), [3]DotexBoard_Interfaces (U4.3)
NetU2_31: [1]DotexBoard_MCU (U2.31), [3]DotexBoard_Interfaces (U4.2)
PA15: [1]DotexBoard_MCU (U2.38), [3]DotexBoard_Interfaces (J11.7)
PB4: [1]DotexBoard_MCU (U2.40), [3]DotexBoard_Interfaces (J11.5)
PB5: [1]DotexBoard_MCU (U2.41), [3]DotexBoard_Interfaces (J11.3)
RX: [1]DotexBoard_MCU (U2.22), [3]DotexBoard_Interfaces (J4.3 max1.9)
TX: [1]DotexBoard_MCU (U2.21), [3]DotexBoard_Interfaces (J4.2 max1.10)